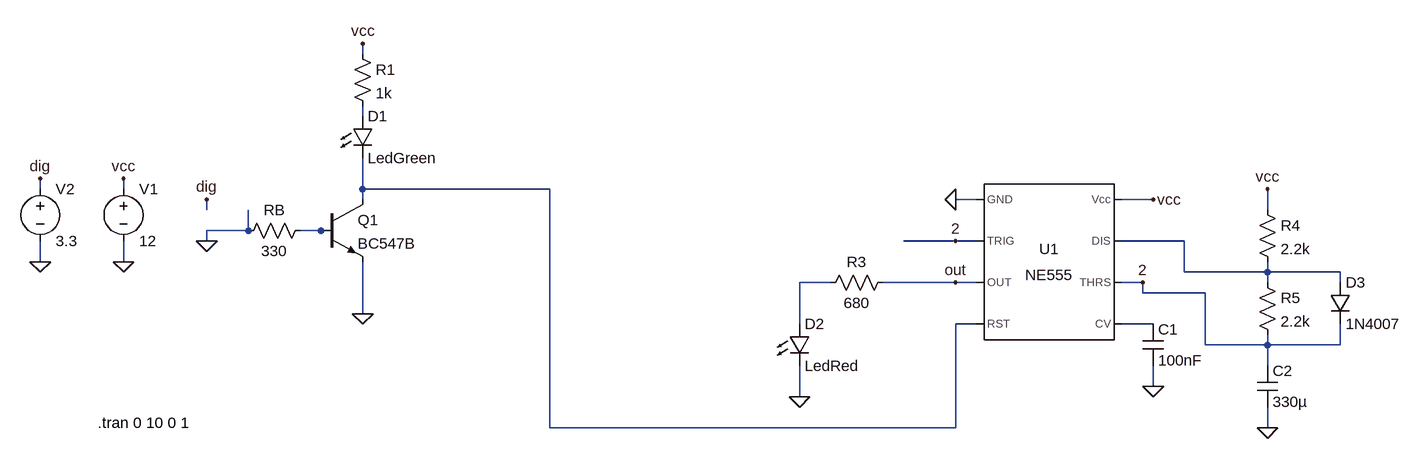
[diagram p0: schematic alarma.asc]
alarma.asc, the LTspice schematic file:
Version 4
SHEET 1 1672 680
WIRE 64 -160 64 -176
WIRE 64 -64 64 -80
WIRE -432 48 -432 32
WIRE -304 48 -304 32
WIRE 64 48 64 0
WIRE 352 48 64 48
WIRE 64 64 64 48
WIRE 1008 64 976 64
WIRE 1280 64 1232 64
WIRE -176 80 -176 64
WIRE 1456 80 1456 48
WIRE -112 112 -112 80
WIRE -112 112 -176 112
WIRE 0 112 -32 112
WIRE 16 112 0 112
WIRE -176 128 -176 112
WIRE 976 128 896 128
WIRE 1008 128 976 128
WIRE 1328 128 1232 128
WIRE -432 160 -432 128
WIRE -304 160 -304 128
WIRE 1328 176 1328 128
WIRE 1456 176 1456 160
WIRE 1456 176 1328 176
WIRE 1568 176 1456 176
WIRE 784 192 736 192
WIRE 976 192 864 192
WIRE 1008 192 976 192
WIRE 1264 192 1232 192
WIRE 1456 192 1456 176
WIRE 1568 192 1568 176
WIRE 1264 208 1264 192
WIRE 1360 208 1264 208
WIRE 64 240 64 160
WIRE 736 256 736 192
WIRE 1008 256 976 256
WIRE 1280 256 1232 256
WIRE 1360 288 1360 208
WIRE 1456 288 1456 272
WIRE 1456 288 1360 288
WIRE 1568 288 1568 256
WIRE 1568 288 1456 288
WIRE 1456 320 1456 288
WIRE 1280 352 1280 320
WIRE 736 368 736 320
WIRE 352 416 352 48
WIRE 976 416 976 256
WIRE 976 416 352 416
WIRE 1456 416 1456 384
FLAG -304 32 vcc
FLAG 976 64 0
FLAG 1280 64 vcc
FLAG 1264 192 2
FLAG 976 128 2
FLAG 1280 352 0
FLAG 976 192 out
FLAG 1456 416 0
FLAG 1456 48 vcc
FLAG -304 160 0
FLAG 64 -176 vcc
FLAG 736 368 0
FLAG -432 32 dig
FLAG -432 160 0
FLAG -176 128 0
FLAG 64 240 0
FLAG -176 64 dig
SYMBOL Misc\\NE555 1120 160 R0
SYMATTR InstName U1
SYMBOL cap 1264 256 R0
SYMATTR InstName C1
SYMATTR Value 100nF
SYMBOL res 1440 64 R0
SYMATTR InstName R4
SYMATTR Value 2.2k
SYMBOL res 1440 176 R0
SYMATTR InstName R5
SYMATTR Value 2.2k
SYMBOL cap 1440 320 R0
SYMATTR InstName C2
SYMATTR Value 330µ
SYMBOL diode 1552 192 R0
SYMATTR InstName D3
SYMATTR Value 1N4007
SYMBOL voltage -304 32 R0
SYMATTR InstName V1
SYMATTR Value 12
SYMBOL npn 0 64 R0
SYMATTR InstName Q1
SYMATTR Value BC547B
SYMBOL res -16 96 R90
WINDOW 0 0 56 VBottom 2
WINDOW 3 32 56 VTop 2
SYMATTR InstName RB
SYMATTR Value 330
SYMBOL LED 720 256 R0
SYMATTR InstName D2
SYMATTR Value LedRed
SYMBOL res 880 176 R90
WINDOW 0 0 56 VBottom 2
WINDOW 3 32 56 VTop 2
SYMATTR InstName R3
SYMATTR Value 680
SYMBOL voltage -432 32 R0
SYMATTR InstName V2
SYMATTR Value 3.3
SYMBOL LED 48 -64 R0
SYMATTR InstName D1
SYMATTR Value LedGreen
SYMBOL res 48 -176 R0
SYMATTR InstName R1
SYMATTR Value 1k
TEXT -344 408 Left 2 !.tran 0 10 0 1

The netlist it stands for:
* alarma.asc
XU1 0 2 out N002 N006 2 N004 vcc NE555  ; pins GND TRIG OUT RST CV THRS DIS Vcc
C1 N006 0 100nF
R4 vcc N004 2.2k
R5 N004 2 2.2k
C2 2 0 330µ
D3 N004 2 1N4007
V1 vcc 0 12
Q1 N002 N003 0 0 BC547B
RB N003 0 330
D2 N005 0 LedRed
R3 out N005 680
V2 dig 0 3.3
D1 N001 N002 LedGreen
R1 vcc N001 1k
.model D D
.lib standard.dio
.model NPN NPN
.model PNP PNP
.lib standard.bjt
.tran 0 10 0 1
.lib NE555.sub
.backanno
.end